# EAGLE schematic three_slaves_328P (EAGLE 7.5.0)
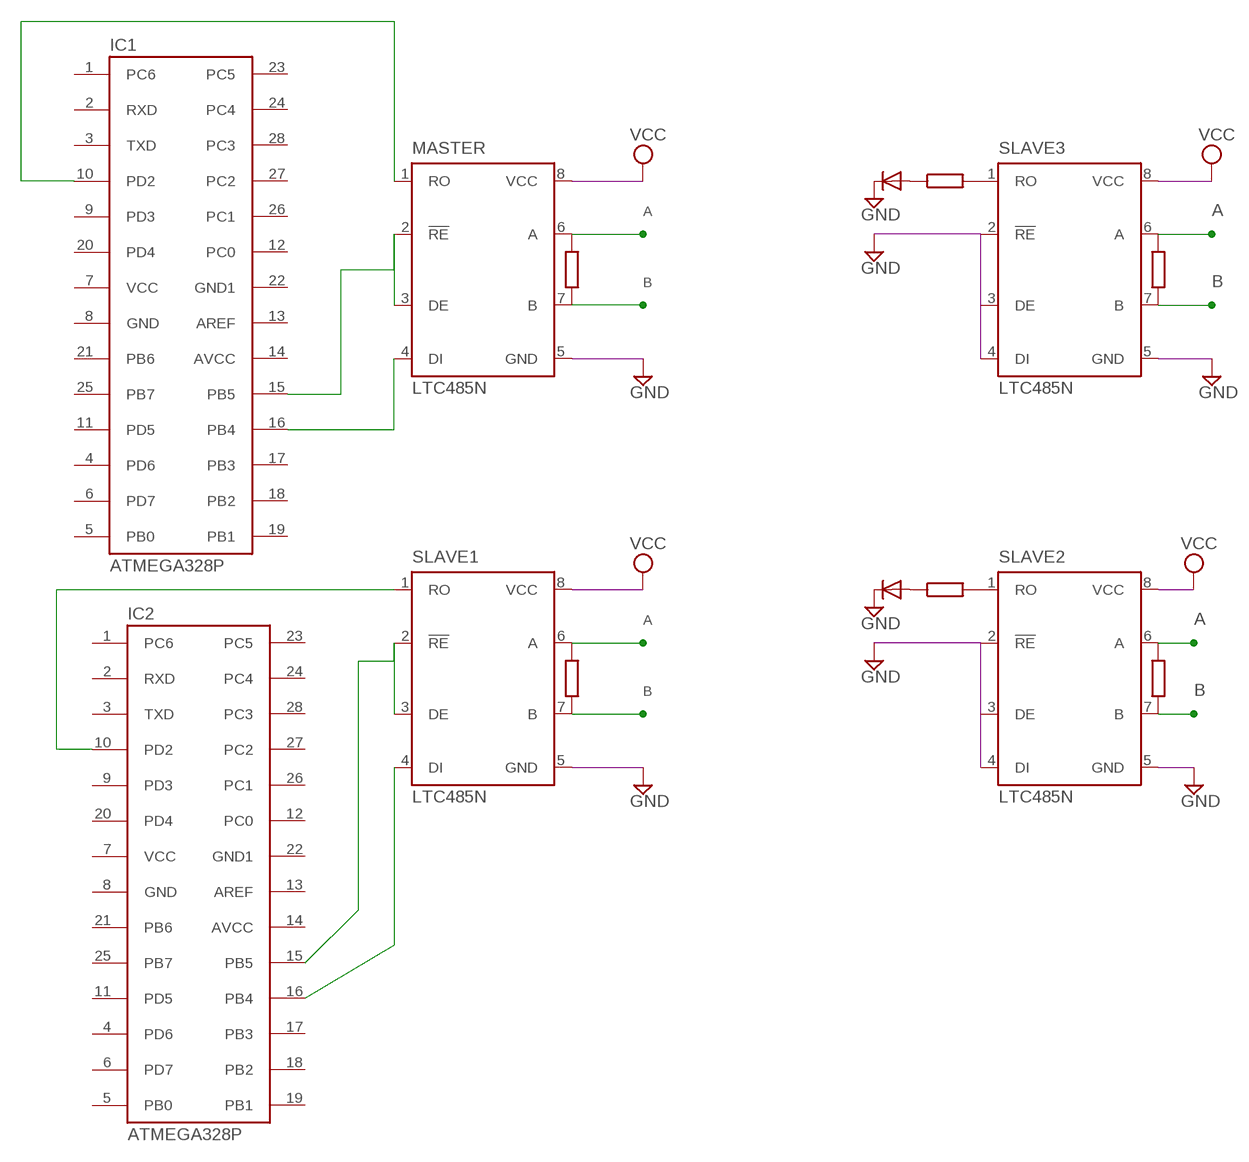
[diagram p0: schematic, sheet 1]

## Parts
D2  1N4004  [DO41-10]
D3  1N4004  [DO41-10]
IC1  ATMEGA328P  [DIL28-3]
IC2  ATMEGA328P  [DIL28-3]
MASTER  LTC485N  [DIL08]
SLAVE1  LTC485N  [DIL08]
SLAVE2  LTC485N  [DIL08]
SLAVE3  LTC485N  [DIL08]

## Nets
A: MASTER.6(A) SLAVE1.6(A) SLAVE2.6(A) SLAVE3.6(A)
B: MASTER.7(B) SLAVE1.7(B) SLAVE2.7(B) SLAVE3.7(B)
GND: D2.C D3.C
N$1: IC1.15(PB5) MASTER.2(!RE) MASTER.3(DE)
N$2: IC1.16(PB4) MASTER.4(DI)
N$3: IC1.10(PD2) MASTER.1(RO)
N$4: IC2.15(PB5) SLAVE1.2(!RE) SLAVE1.3(DE)
N$5: IC2.16(PB4) SLAVE1.4(DI)
N$6: IC2.10(PD2) SLAVE1.1(RO)
Unconnected: D2.A D3.A IC1.1(PC6) IC1.2(RXD) IC1.3(TXD) IC1.4(PD6) IC1.5(PB0) IC1.6(PD7) IC1.9(PD3) IC1.11(PD5) IC1.12(PC0) IC1.13(AREF) IC1.14(AVCC) IC1.17(PB3) IC1.18(PB2) IC1.19(PB1) IC1.20(PD4) IC1.21(PB6) IC1.23(PC5) IC1.24(PC4) IC1.25(PB7) IC1.26(PC1) IC1.27(PC2) IC1.28(PC3) IC2.1(PC6) IC2.2(RXD) IC2.3(TXD) IC2.4(PD6) IC2.5(PB0) IC2.6(PD7) IC2.9(PD3) IC2.11(PD5) IC2.12(PC0) IC2.13(AREF) IC2.14(AVCC) IC2.17(PB3) IC2.18(PB2) IC2.19(PB1) IC2.20(PD4) IC2.21(PB6) IC2.23(PC5) IC2.24(PC4) IC2.25(PB7) IC2.26(PC1) IC2.27(PC2) IC2.28(PC3) MASTER.5(GND) MASTER.8(VCC) SLAVE1.5(GND) SLAVE1.8(VCC) SLAVE2.1(RO) SLAVE2.2(!RE) SLAVE2.3(DE) SLAVE2.4(DI) SLAVE2.5(GND) SLAVE2.8(VCC) SLAVE3.1(RO) SLAVE3.2(!RE) SLAVE3.3(DE) SLAVE3.4(DI) SLAVE3.5(GND) SLAVE3.8(VCC)

## Power pins joined to a net without a drawn wire
GND: IC1.8(GND) IC2.8(GND)
GND1: IC1.22(GND1) IC2.22(GND1)
VCC: IC1.7(VCC) IC2.7(VCC)

## Library data of the parts
D2 D3 = diode:1N4004: DIODE general purpose rectifier, 1 A
IC1 IC2 = Arduino-AVR:ATMEGA328P
MASTER SLAVE1-SLAVE3 = linear-technology:LTC485: Low Power RS485 Interface Transceiver Source: http://www.linear.com/pc/downloadDocument.do?navId=H0,C1,C1007,C1017,P2064,D1718; OC_FARNELL: unknown; OC_NEWARK: unknown